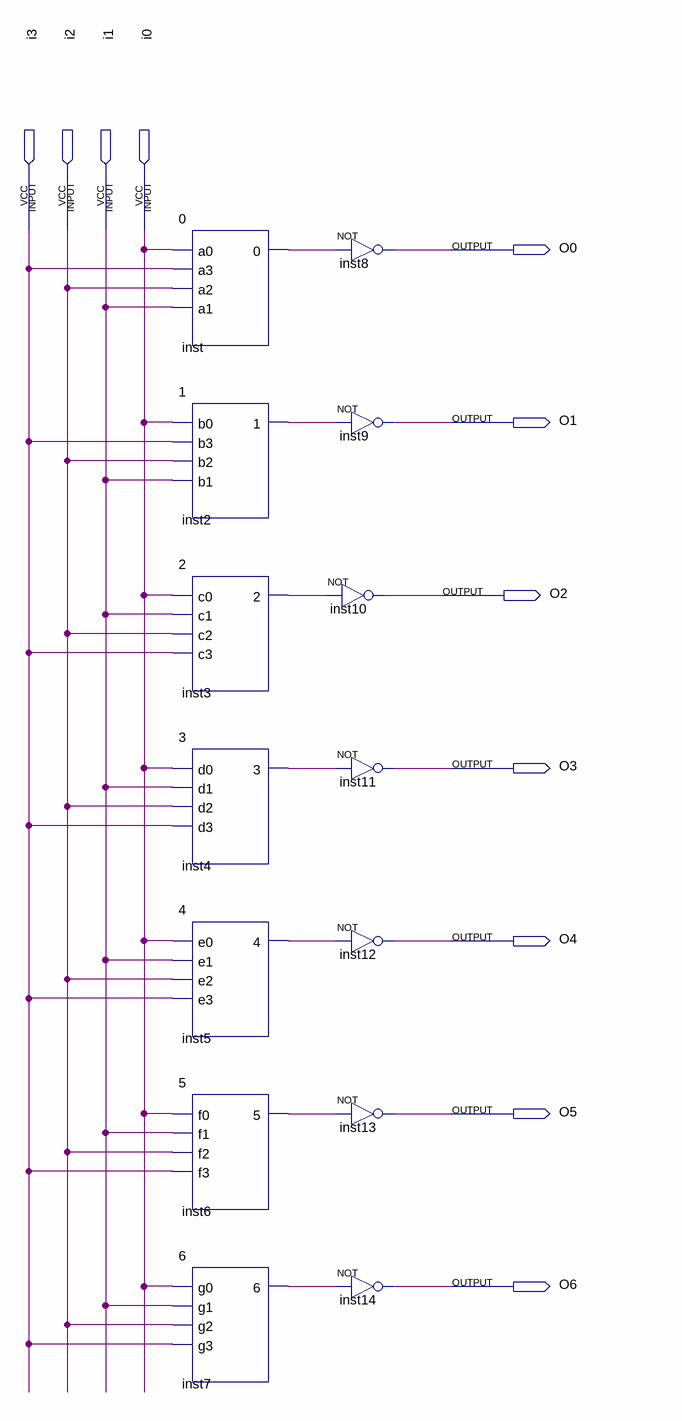
[diagram p0: schematic sheet]
// Quartus schematic SSDD.bdf as structural Verilog: 14 symbols, 11 pins
module SSDD (
  input  i3,
  input  i2,
  input  i1,
  input  i0,
  output O0,
  output O1,
  output O2,
  output O3,
  output O4,
  output O5,
  output O6
);

  wire inst2_1, inst3_2, inst4_3, inst5_4, inst6_5, inst7_6, inst_0;

  \0  inst (.a0(i0), .a3(i3), .a2(i2), .a1(i1), .\0 (inst_0));
  \1  inst2 (.b0(i0), .b3(i3), .b2(i2), .b1(i1), .\1 (inst2_1));
  \2  inst3 (.c0(i0), .c1(i1), .c2(i2), .c3(i3), .\2 (inst3_2));
  \3  inst4 (.d0(i0), .d1(i1), .d2(i2), .d3(i3), .\3 (inst4_3));
  \4  inst5 (.e0(i0), .e1(i1), .e2(i2), .e3(i3), .\4 (inst5_4));
  \5  inst6 (.f0(i0), .f1(i1), .f2(i2), .f3(i3), .\5 (inst6_5));
  \6  inst7 (.g0(i0), .g1(i1), .g2(i2), .g3(i3), .\6 (inst7_6));
  not inst8 (O0, inst_0);
  not inst9 (O1, inst2_1);
  not inst10 (O2, inst3_2);
  not inst11 (O3, inst4_3);
  not inst12 (O4, inst5_4);
  not inst13 (O5, inst6_5);
  not inst14 (O6, inst7_6);
endmodule
